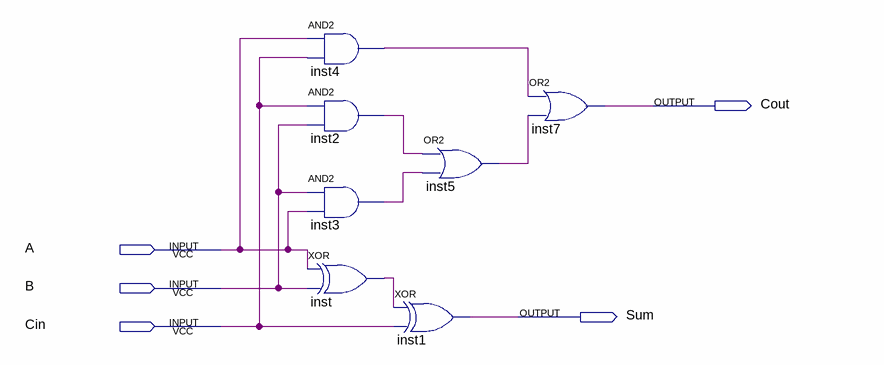
[diagram p0: schematic sheet]
// Quartus schematic Ex6_single.bdf as structural Verilog: 7 symbols, 5 pins
module Ex6_single (
  input  A,
  input  B,
  input  Cin,
  output Cout,
  output Sum
);

  wire inst2_out, inst3_out, inst4_out, inst5_out, inst_out;

  and inst4 (inst4_out, A, Cin);
  and inst2 (inst2_out, Cin, B);
  and inst3 (inst3_out, B, A);
  xor inst (inst_out, A, B);
  xor inst1 (Sum, inst_out, Cin);
  or inst5 (inst5_out, inst2_out, inst3_out);
  or inst7 (Cout, inst4_out, inst5_out);
endmodule
